# Altium schematic sheet usb_input.SchDoc
size A4; SheetNumber: 4; SheetTotal: 7
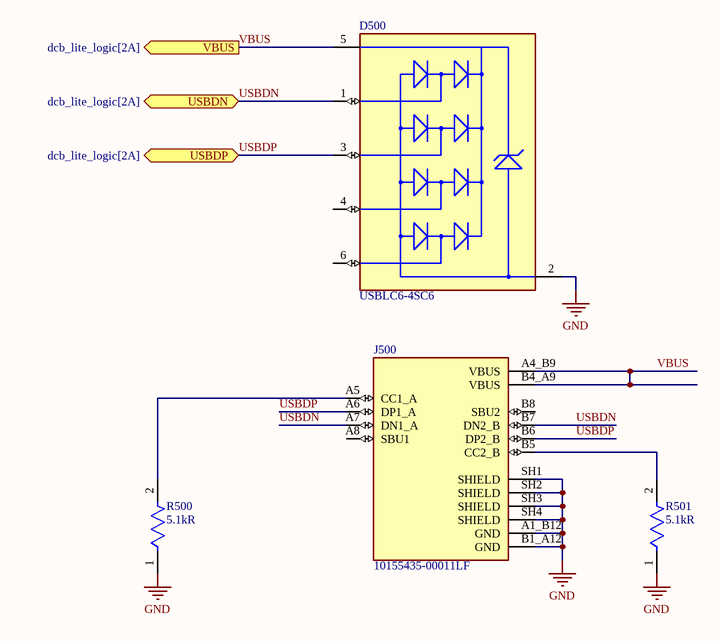
[diagram p0: usb_input.SchDoc]

## Parts
D500  USBLC6-4SC6  [FP-SOT23-6L-MFG]
J500  10155435-00011LF  [AMPHENOL_10155435-00011LF]
R500  value 5.1kR  [FP-AC0402-IPC_A]  (hidden comment: AC0402FR-075K1L)
R501  value 5.1kR  [FP-AC0402-IPC_A]  (hidden comment: AC0402FR-075K1L)

## Ports
USBDN (bidir, see dcb_lite_logic[2A]), USBDP (bidir, see dcb_lite_logic[2A]), VBUS (out, see dcb_lite_logic[2A])

## Nets
GND: D500.2(GND) J500.A1_B12(GND) J500.B1_A12(GND) J500.SH1(SHIELD) J500.SH2(SHIELD) J500.SH3(SHIELD) J500.SH4(SHIELD) R500.1 R501.1
USBDN: D500.1(I/O1) J500.A7(DN1_A) J500.B7(DN2_B) ; port USBDN
USBDP: D500.3(I/O2) J500.A6(DP1_A) J500.B6(DP2_B) ; port USBDP
VBUS: D500.5(VBUS) J500.A4_B9(VBUS) J500.B4_A9(VBUS) ; port VBUS
NetJ500_A5: J500.A5(CC1_A) R500.2
NetJ500_B5: J500.B5(CC2_B) R501.2

Not connected (* = marked no-connect by the designer): D500 4(I/O3) 6(I/O4); J500 A8(SBU1) B8(SBU2)

## Notes on the sheet
- Title
- Size:
- Date:
- A4
- Number:
- Time:
- Revision:
- Sheet
- of
- github.com/blueacro
- blueacro.com
- CERN OHL v2.0
- Made available under the
- File:
- © 2024 StackFoundry LLC. All Rights Reserved.

## Library data of the parts
D500 = CMP-004-00040-1: ESD Suppressor 15KV 6-Pin SOT-23 T/R - Product that comes on tape, but is not reeled; Clamping Voltage-Max: 17V; Direction: Unidirectional; Operating Supply Voltage: 860mV; Max Breakdown Voltage: 10V; Reverse Breakdown Voltage: 6V; Leakage Current: 150nA; Max Reverse Leakage Current: 2uA; Value: 4pF; Power Line Protection: Yes; Peak Pulse Current: 5A; Polarity: Unidirectional,Bidirectional; Number of Channels: 4; Test Current: 1mA; Number of Elements: 1; Voltage Rating (DC): 5V; Max Operating Temperature: 125°C; Termination: SMD/SMT; Case/Package: SOT-23; Reach SVHC Compliant: No; Width: 1.75mm; Lead Free: Lead Free; Packaging: Tape and Reel; Radiation Hardening: No; Length: 3.05mm; Pins: 6; Mounting Technology: Surface Mount; Min Operating Temperature: -40°C; Depth: 1.75mm; ESD Protection: Yes; Clamping Voltage: 17V; RoHS Compliant: Yes; Height: 1.3mm; Series: USB; Min Breakdown Voltage: 6V; Working Voltage: 5V; Breakdown Voltage: 6V; Number of Unidirectional Channels: 4; Reverse Standoff Voltage: 5V
J500 = CMP-243-000000-3: 16 Position 5 A USB Right Angle Receptacle Connector; MF: Amphenol ICC (FCI); MP: 10155435-00011LF; Availability: Unavailable; Design Item ID: 10155435-00011LF; Source: 10155435-00011LF.SchLib; Price: None; Package: None; Component Type: Standard; Value: *; Pin Count: 16
R500 R501 = CMP-009-00234-1: SMD Chip Resistor, 5.1 kOhm, ± 1%, 63 mW, 0402 [1005 Metric], Thick Film, General Purpose; Power Rating: 63mW; Temperature Coefficient: 100ppm/°C; Voltage Rating: 50V; Height: 0.015inch; Case/Package: 0402; Features: Moisture Resistant,Automotive AEC-Q200; Max Operating Temperature: 155°C; Case Code (Metric): 1005; Max Power Dissipation: 63mW; Width: 0.02inch; Packaging: Cut Tape; Min Operating Temperature: -55°C; Series: AC; Case Code (Imperial): 0402; Mounting Technology: Surface Mount; Tolerance: 1%; Lead Free: Lead Free; Length: 0.039inch; RoHS Compliant: Yes; Number of Terminations: 2